# Altium schematic sheet NNP-DWG-125-001-000 PG4 Schematic Drawing Pg6.SchDoc
size B; Address1: 300 Artini St.; Address2: Oberlin, OH  44074; DocumentNumber: 51-2002-01; Revision: 04; SheetNumber: 6; SheetTotal: 8; PageSetup: Record=PageOptions|CenterHorizontal=True|CenterVertical=True|PrintScale=1.09|XCorrection=1.00|YCorrection=1.00|PrintKind=0|BorderSize=5000000|LeftOffset=0|BottomOffset=0|Orientation=2|PaperLength=4318|PaperWidth=2794|Scale=100|PaperSource=7|PrintQuality=-3|MediaType=1|DitherType=10|PrintScaleMode=1|PaperKind=11" x 17"|PaperIndex=17; DocName: **
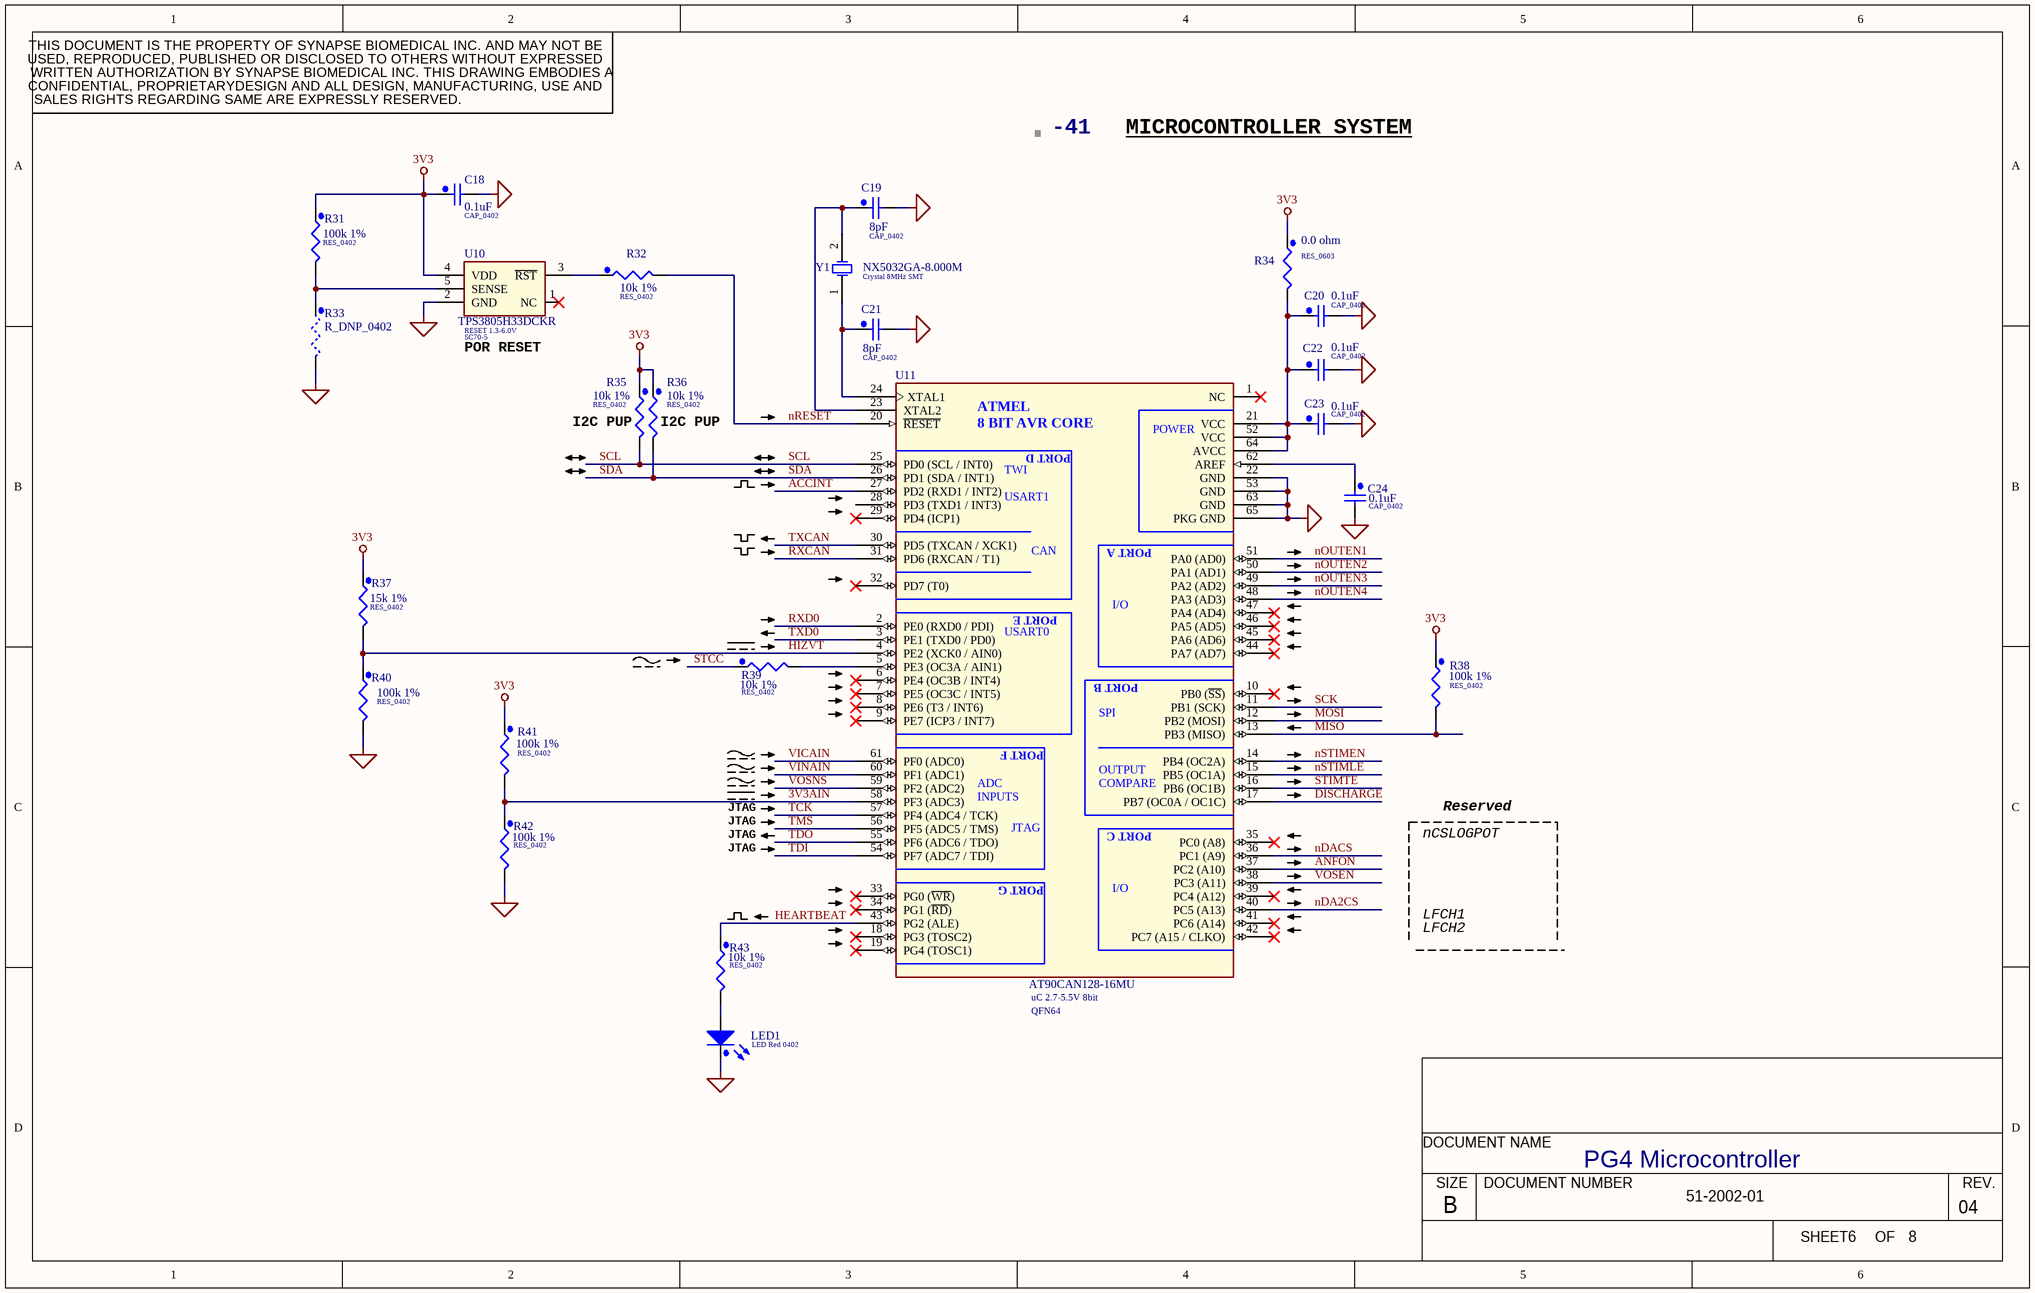
[diagram p0: NNP-DWG-125-001-000 PG4 Schematic Drawing Pg6.SchDoc]

## Parts
-41  XDESCRIPTION: MICROCONTROLLER SYSTEM  (hidden comment: BOM_S1)  (no BOM)
C18  value 0.1uF  [CAP_0402]  (hidden comment: C_100n_X7R_16_0402_10%)
C19  value 8pF  [CAP_0402]  (hidden comment: C_8p_C0G_50_0402)
C20  value 0.1uF  [CAP_0402]  (hidden comment: C_100n_X7R_16_0402_10%)
C21  value 8pF  [CAP_0402]  (hidden comment: C_8p_C0G_50_0402)
C22  value 0.1uF  [CAP_0402]  (hidden comment: C_100n_X7R_16_0402_10%)
C23  value 0.1uF  [CAP_0402]  (hidden comment: C_100n_X7R_16_0402_10%)
C24  value 0.1uF  [CAP_0402]  (hidden comment: C_100n_X7R_16_0402_10%)
LED1  LED Red 0402  [LED_0402_RED]
R31  value 100k 1%  [RES_0402]  (hidden comment: R_100k_0402)
R32  value 10k 1%  [RES_0402]  (hidden comment: R_10k_0402)
R33  R_DNP_0402  [RES_0402]  (no BOM)
R34  value 0.0 ohm  [RES_0603]  (hidden comment: R_0_0603)
R35  value 10k 1%  [RES_0402]  (hidden comment: R_10k_0402)
R36  value 10k 1%  [RES_0402]  (hidden comment: R_10k_0402)
R37  value 15k 1%  [RES_0402]  (hidden comment: R_15k_0402)
R38  value 100k 1%  [RES_0402]  (hidden comment: R_100k_0402)
R39  value 10k 1%  [RES_0402]  (hidden comment: R_10k_0402)
R40  value 100k 1%  [RES_0402]  (hidden comment: R_100k_0402)
R41  value 100k 1%  [RES_0402]  (hidden comment: R_100k_0402)
R42  value 100k 1%  [RES_0402]  (hidden comment: R_100k_0402)
R43  value 10k 1%  [RES_0402]  (hidden comment: R_10k_0402)
U10  RESET 1.3-6.0V  MPN: TPS3805H33DCKR  [SC70-5]
U11  uC 2.7-5.5V 8bit  MPN: AT90CAN128-16MU  [QFN64]
Y1  Crystal 8MHz SMT  MPN: NX5032GA-8.000M  [NX5032GA]

## Nets
3V3: C18.1 R31.1 R34.1 R35.1 R36.1 R37.1 R38.1 R41.1 U10.4(VDD)
GND: C18.2 C19.2 C20.2 C21.2 C22.2 C23.2 C24.2 LED1.1(C) R33.2 R40.2 R42.2 U10.2(GND) U11.22(GND) U11.53(GND) U11.63(GND) U11.65(PKG_GND)
3V3AIN: R41.2 R42.1 U11.58(PF3_(ADC3))
ACCINT: U11.27(PD2_(RXD1_/_INT2))
ANFON: U11.37(PC2_(A10))
DISCHARGE: U11.17(PB7_(OC0A_/_OC1C))
HEARTBEAT: R43.1 U11.43(PG2_(ALE))
HIZVT: R37.2 R40.1 U11.4(PE2_(XCK0_/_AIN0))
MISO: R38.2 U11.13(PB3_(MISO))
MOSI: U11.12(PB2_(MOSI))
nDA2CS: U11.40(PC5_(A13))
nDACS: U11.36(PC1_(A9))
nOUTEN1: U11.51(PA0_(AD0))
nOUTEN2: U11.50(PA1_(AD1))
nOUTEN3: U11.49(PA2_(AD2))
nOUTEN4: U11.48(PA3_(AD3))
nRESET: R32.2 U11.20(~{RESET})
nSTIMEN: U11.14(PB4_(OC2A))
nSTIMLE: U11.15(PB5_(OC1A))
RXCAN: U11.31(PD6_(RXCAN_/_T1))
RXD0: U11.2(PE0_(RXD0_/_PDI))
SCK: U11.11(PB1_(SCK))
SCL: R35.2 U11.25(PD0_(SCL_/_INT0))
SDA: R36.2 U11.26(PD1_(SDA_/_INT1))
STCC: R39.1
STIMTE: U11.16(PB6_(OC1B))
TCK: U11.57(PF4_(ADC4_/_TCK))
TDI: U11.54(PF7_(ADC7_/_TDI))
TDO: U11.55(PF6_(ADC6_/_TDO))
TMS: U11.56(PF5_(ADC5_/_TMS))
TXCAN: U11.30(PD5_(TXCAN_/_XCK1))
TXD0: U11.3(PE1_(TXD0_/_PD0))
VICAIN: U11.61(PF0_(ADC0))
VINAIN: U11.60(PF1_(ADC1))
VOSEN: U11.38(PC3_(A11))
VOSNS: U11.59(PF2_(ADC2))
NetC19_1: C19.1 U11.23(XTAL2) Y1.2(OSC2)
NetC20_1: C20.1 C22.1 C23.1 R34.2 U11.21(VCC) U11.52(VCC) U11.64(AVCC)
NetC21_1: C21.1 U11.24(XTAL1) Y1.1(OSC1)
NetC24_1: C24.1 U11.62(AREF)
NetLED1_2: LED1.2(A) R43.2
NetR31_2: R31.2 R33.1 U10.5(SENSE)
NetR32_1: R32.1 U10.3(~{RST})
NetR39_2: R39.2 U11.5(PE3_(OC3A_/_AIN1))

Not connected (* = marked no-connect by the designer): U10 1(NC)*; U11 1(NC)* 6(PE4_(OC3B_/_INT4))* 7(PE5_(OC3C_/_INT5))* 8(PE6_(T3_/_INT6))* 9(PE7_(ICP3_/_INT7))* 10(PB0_(~{SS}))* 18(PG3_(TOSC2))* 19(PG4_(TOSC1))* 28(PD3_(TXD1_/_INT3)) 29(PD4_(ICP1))* 32(PD7_(T0))* 33(PG0_(~{WR}))* 34(PG1_(~{RD}))* 35(PC0_(A8))* 39(PC4_(A12))* 41(PC6_(A14))* 42(PC7_(A15_/_CLKO))* 44(PA7_(AD7))* 45(PA6_(AD6))* 46(PA5_(AD5))* 47(PA4_(AD4))*

## Notes on the sheet
- (near U10) POR RESET
- (near R35) I2C PUP
- (near R36) I2C PUP
- JTAG
- nCSLOGPOT
- Reserved
- LFCH1
- LFCH2
- PG4 Microcontroller
- SALES RIGHTS REGARDING SAME ARE EXPRESSLY RESERVED.
- THIS DOCUMENT IS THE PROPERTY OF SYNAPSE BIOMEDICAL INC. AND MAY NOT BE
- USED, REPRODUCED, PUBLISHED OR DISCLOSED TO OTHERS WITHOUT EXPRESSED
- CONFIDENTIAL, PROPRIETARYDESIGN AND ALL DESIGN, MANUFACTURING, USE AND
- WRITTEN AUTHORIZATION BY SYNAPSE BIOMEDICAL INC. THIS DRAWING EMBODIES A
- DOCUMENT NAME
- SIZE
- B
- DOCUMENT NUMBER
- SHEET
- OF
- REV.
- (in symbol AT90CAN128-16MI) ATMEL / 8 BIT AVR CORE; POWER; PORT D; TWI; USART1; PORT A; CAN; PORT E; I/O; USART0; PORT B; SPI; PORT F; OUTPUT COMPARE; ADC INPUTS; PORT C; JTAG; PORT G

## Library data of the parts
-41 = BOM_S1: BOM item small graphic
C18 C20 C22-C24 = GRM155R71C104KA88D: 0.1uF, 16V, X7R, 0402, RoHS; MFR: Murata Electronics North America; VTPN: CC5100-KJX16R13; SBI: 51-0040-1; NNPN: 00-20-1072; PackageDescription: CAP_0402; Supplier 1: Digi-Key; Supplier Part Number 1: 490-3261-2-ND; MPN: GRM155R71C104KA88D
C19 C21 = ECJ-0EC1H080D: 8pF, 50V, C0G, 0402, 10%, RoHS; MFR: Murata Electronics North America; MPN: GRM1555C1H8R0DA01D; VTPN: CC0800-DJN50RC7; SBI: 53-0044; NNPN: 00-20-0549; PackageDescription: CAP_0402; Supplier 1: Digi-Key; Supplier Part Number 1: 490-5867-6-ND
LED1 = SML-LX0402SIC-TR: LED, Red, 0402, 20mA ,2V, 140mcd, RoHS; MFR: Lumex Opto/Components Inc.; VTPN: LED00S-RED0RC7; SBI: 53-0035; NNPN: 00-09-1005; PackageDescription: 0402; Supplier 1: Digi-Key; Supplier Part Number 1: 67-1878-1-ND; MPN: SML-LX0402SIC-TR
R31 R38 R40-R42 = MCR01MZPF1003: 100k ohm, 1%, 1/16W, smd, 0402, RoHS; MFR: Vishay Dale; MPN: CRCW04025K10FKED; VTPN: RC5100-FI006R15; sbi: 53-0049-5; NNPN: 00-11-1484; PackageDescription: RES_0402; Supplier 1: Digi-Key; Supplier Part Number 1: 541-5.10KLDKR-ND
R32 R35 R36 R39 R43 = MCR01MZPF1002: 10.0k ohm, 1%, 1/16W, smd, 0402, RoHS; MFR: Vishay Dale; MPN: CRCW040210K0FKED; VTPN: RC4100-FI006R17; SBI: 53-0048-8; NNPN: 00-11-1388; PackageDescription: RES_0402; Supplier 1: Digi-Key; Supplier Part Number 1: 541-10.0KLDKR-ND
R33 = R_DNP_0402: 0.0 ohm 1/16W smd 0402 RoHS; MFR: DO NOT POPULATE; MPN: DO NOT POPULATE; PackageDescription: RES_0402
R34 = MCR03ERTJ000: 0.0 ohm, 1/10W, 0603, RoHS; MFR: Vishay Dale; VTPN: RC0000-BH010RC9; SBI: 53-0050; NNPN: 00-11-2000; PackageDescription: RES_0603; Supplier 1: Digi-Key; Supplier Part Number 1: RHM0.0CGCT-ND; MPN: MCR03ERTJ000
R37 = MCR01MZPF1502: 15.0k ohm, 1%, 1/16W, smd, 0402, RoHS; MFR: Vishay Dale; MPN: CRCW040215K0FKED; VTPN: RC4150-FI006RC9; SBI: 53-0049-9; NNPN: 00-11-1405; PackageDescription: RES_0402; Supplier 1: Digi-Key; Supplier Part Number 1: 541-15.0KLDKR-ND
U10 = TPS3805H33: Voltage detector Reset, SC70-5, RoHS; MFR: Texas Instruments; VTPN: ELRTPS380-SRC7; SBI: 54-0060; NNPN: 00-04-1017; PackageDescription: SC70-5; Supplier 1: Digi-Key; Supplier Part Number 1: 296-13407-6-ND
U11 = AT90CAN128-16MI: uC, 2.7-5.5V, 8bit, QFN64, RoHS; MFR: Atmel; VTPN: EINAT90CA-SRC7; SBI: 54-0061; NNPN: 00-04-2110; PackageDescription: QFN64; Supplier 1: Digi-Key; Supplier Part Number 1: AT90CAN128-16MURDKR-ND; Value: *
Y1 = NX5032GA: Crystal 8MHz SMT, RoHS; MFR: NDK; VTPN: XC080000-0SRC7; SBI: 54-0073; Supplier 1: Digi-Key; Supplier Part Number 1: 644-1132-6-ND; NNPN: 00-08-0018; VALUE: 8MHz